# EAGLE design controller + diods + lcd (EAGLE 9.6.2)
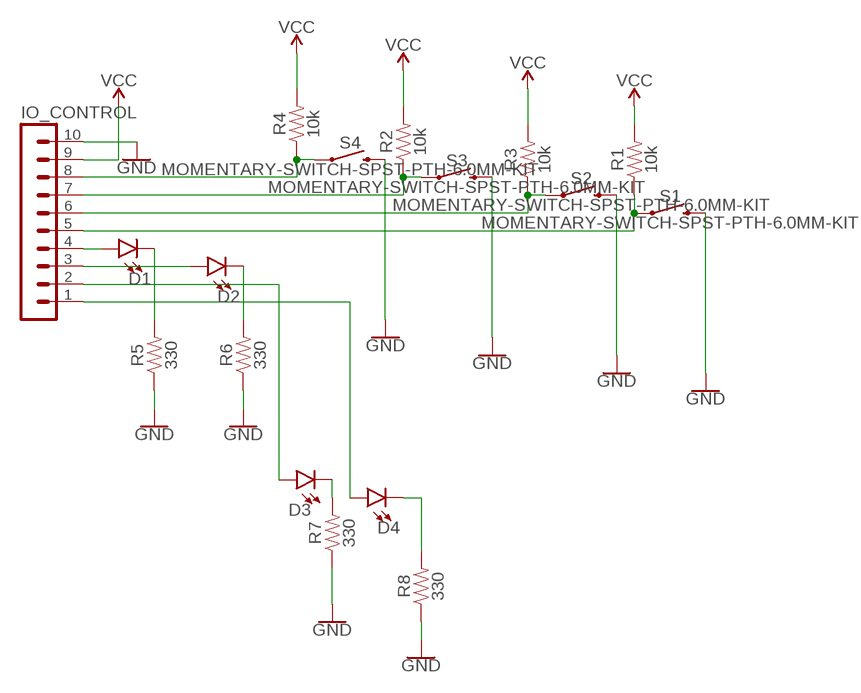
[diagram p0: schematic, sheet 1]

## Parts
D1  LED10MM  [LED_10MM]
D2  LED10MM  [LED_10MM]
D3  LED10MM  [LED_10MM]
D4  LED10MM  [LED_10MM]
IO_CONTROL  MA10-1  [MA10-1]
R1  10k  10KOHM-HORIZ_KIT-1/6W-5%  [AXIAL-0.3-KIT]
R2  10k  10KOHM-HORIZ_KIT-1/6W-5%  [AXIAL-0.3-KIT]
R3  10k  10KOHM-HORIZ_KIT-1/6W-5%  [AXIAL-0.3-KIT]
R4  10k  10KOHM-HORIZ_KIT-1/6W-5%  [AXIAL-0.3-KIT]
R5  330  330OHM-HORIZ-1/10W-5%  [AXIAL-0.3]
R6  330  330OHM-HORIZ-1/10W-5%  [AXIAL-0.3]
R7  330  330OHM-HORIZ-1/10W-5%  [AXIAL-0.3]
R8  330  330OHM-HORIZ-1/10W-5%  [AXIAL-0.3]
S1  MOMENTARY-SWITCH-SPST-PTH-6.0MM-KIT  [TACTILE_SWITCH_PTH_6.0MM_KIT]
S2  MOMENTARY-SWITCH-SPST-PTH-6.0MM-KIT  [TACTILE_SWITCH_PTH_6.0MM_KIT]
S3  MOMENTARY-SWITCH-SPST-PTH-6.0MM-KIT  [TACTILE_SWITCH_PTH_6.0MM_KIT]
S4  MOMENTARY-SWITCH-SPST-PTH-6.0MM-KIT  [TACTILE_SWITCH_PTH_6.0MM_KIT]

## Nets
GND: IO_CONTROL.10 R5.P$1 R6.P$1 R7.P$1 R8.P$1 S1.3 S2.3 S3.3 S4.3
N$2: IO_CONTROL.6 R3.P$1 S2.1
N$3: IO_CONTROL.7 R2.P$1 S3.1
N$4: IO_CONTROL.8 R4.P$1 S4.1
N$5: D1.A IO_CONTROL.4
N$6: D1.C R5.P$2
N$7: D2.A IO_CONTROL.3
N$8: D2.C R6.P$2
N$9: D3.A IO_CONTROL.2
N$10: D3.C R7.P$2
N$11: D4.A IO_CONTROL.1
N$12: D4.C R8.P$2
N$13: IO_CONTROL.5 R1.P$1 S1.1
VCC: IO_CONTROL.9 R1.P$2 R2.P$2 R3.P$2 R4.P$2

## Library data of the parts
D1-D4 = SparkFun-LED:LED: LED (Generic) Standard schematic elements and footprints for 5mm, 3mm, 1206, and 0603 sized LEDs. Generic LEDs with no color specified.
IO_CONTROL = con-lstb:MA10-1: PIN HEADER; OC_FARNELL: unknown; OC_NEWARK: unknown
R1-R4 = SparkFun-Resistors:10KOHM: 10kΩ resistor A resistor is a passive two-terminal electrical component that implements electrical resistance as a circuit element. Resistors act to reduce current flow, and, at the same time, act to lower voltage levels within circuits. - Wikipedia; PROD_ID: RES-08375
R5-R8 = SparkFun-Resistors:330OHM: 330Ω resistor A resistor is a passive two-terminal electrical component that implements electrical resistance as a circuit element. Resistors act to reduce current flow, and, at the same time, act to lower voltage levels within circuits. - Wikipedia; PROD_ID: RES-8371
S1-S4 = SparkFun-Switches:MOMENTARY-SWITCH-SPST: Momentary Switch (Pushbutton) - SPST Normally-open (NO) SPST momentary switches (buttons, pushbuttons). Variants PTH-12MM - 12mm square, through-hole Momentary Pushbutton Switch - 12mm Square <https://www.sparkfun.com/products/9190> (COM-09190) PTH-6.0MM, PTH-6.0MM-KIT - 6.0mm square, through-hole Mini Pushbutton Switch <https://www.sparkfun.com/products/97> (COM-00097) KIT package intended for soldering kit's - only one side of pads' copper is exposed. PTH-RIGHT-ANGLE-KIT - Right-angle, through-hole Right Angle Tactile Button <https://www.sparkfun.com/products/10791> - Used on SparkFun BigTime Watch Kit <https://www.sparkfun.com/products/11734> SMD-12MM - 12mm square, surface-mount Tactile Button - SMD (12mm) <https://www.sparkfun.com/products/12993> (COM-12993) Used on SparkFun PicoBoard <https://www.sparkfun.com/products/11888> SMD-4.5MM - 4.5mm Square Trackball Switch Used on SparkFun Blackberry Trackballer Breakout <https://www.sparkfun.com/products/13169> SMD-4.6MMX2.8MM - 4.60mm x 2.80mm, surface mount Used on SparkFun Pro Micro - RP2040 <https://www.sparkfun.com/products/17717> SMD-5.2MM, SMD-5.2-REDUNDANT - 5.2mm square, surface-mount Mini Pushbutton Switch - SMD <https://www.sparkfun.com/products/8720> (COM-08720) Used on Arduino Pro Mini <https://www.sparkfun.com/products/11114> REDUNDANT package connects both switch circuits together SMD-6.0X3.5MM - 6.0 x 3.5mm, surface mount Momentary Reset Switch SMD <https://www.sparkfun.com/products/8229> (COM-08229) SMD-6.2MM-TALL - 6.2mm square, surface mount Tactile Button - SMD (6mm) <https://www.sparkfun.com/products/12992> Used on SparkFun Digital Sandbox <https://www.sparkfun.com/products/12651> SMD-RIGHT-ANGLE - Right-angle, surface mount Used on SparkFun Block for Intel® Edison - Arduino <https://www.sparkfun.com/products/13036>; PROD_ID: SWCH-08441; SF_SKU: COM-00097

## Board
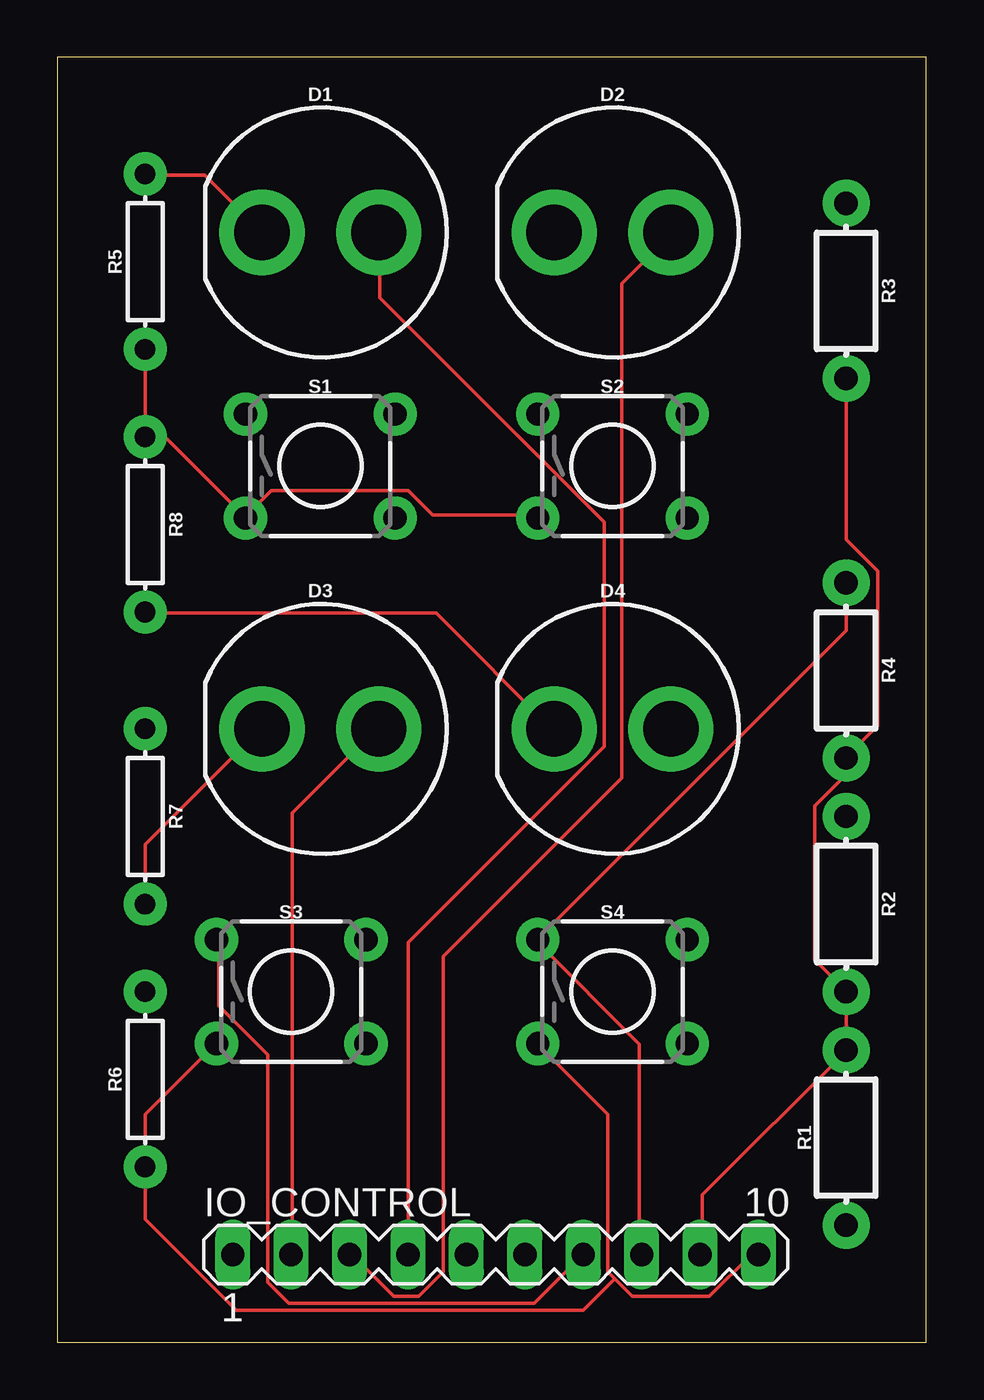
[diagram p1: board, top side]
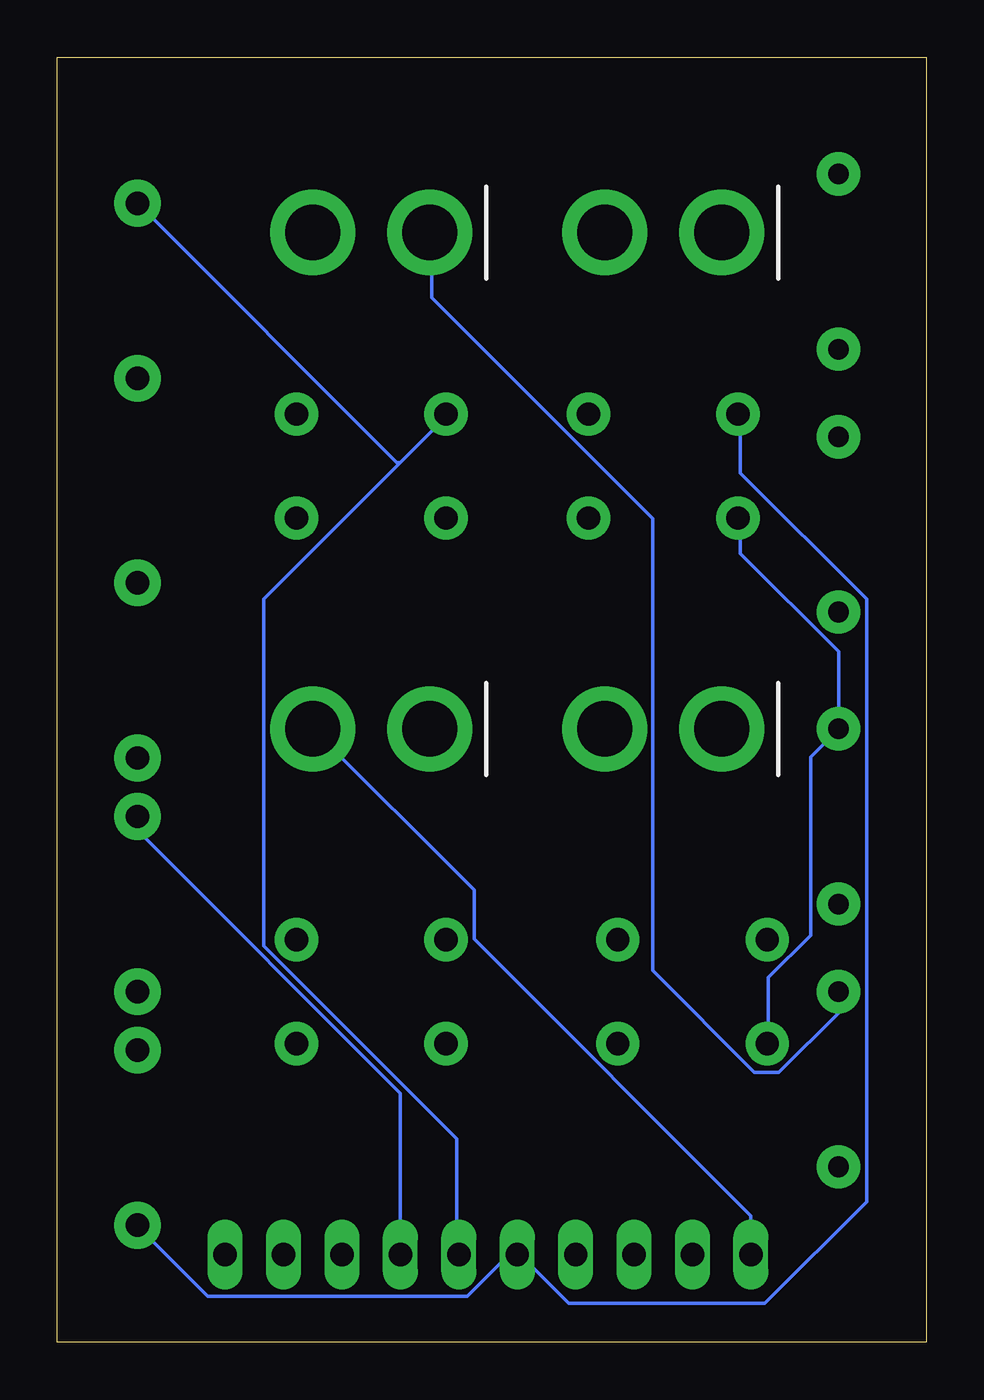
[diagram p2: board, bottom side, seen from below]

Size 37.77 x 55.87 mm. Coordinates in mm from the lower left corner, seen from the top.
Outline: 0,0 37.77,0 37.77,55.87 0,55.87 0,0
Copper layers (1*16): Top 0.035mm / dielectric 1.5mm / Bottom 0.035mm
Design rules "default": minimum track width 6mil, minimum drill 0.35mm, track to track 6mil, track to pad 6mil, pad to pad 6mil, via to via 6mil, smd to smd 6mil, copper to edge 40mil, drill to drill 6mil, minimum pad ring 10mil, minimum via ring 8mil, stop-mask expansion 4mil, vias tented up to drill 0mil, thermal gap 10mil

### Footprints (pad centres in the part's own frame; a part is rotated, then mirrored left to right if it is on the bottom)
LED_10MM = drill 2.4 pad 3.7: A 2.54,0; C -2.54,0
MA10-1 = drill 1.016 long: 1 -11.43,0; 2 -8.89,0; 3 -6.35,0; 4 -3.81,0; 5 -1.27,0; 6 1.27,0; 7 3.81,0; 8 6.35,0; 9 8.89,0; 10 11.43,0
AXIAL-0.3-KIT = drill 1.016 pad 2.032: P$1 -3.81,0; P$2 3.81,0
AXIAL-0.3 = drill 0.9 pad 1.88: P$1 -3.81,0; P$2 3.81,0
TACTILE_SWITCH_PTH_6.0MM_KIT = drill 1.016 pad 1.88: 1 -3.251,2.261; 2 3.251,2.261; 3 -3.251,-2.261; 4 3.251,-2.261

### Placement (x,y rotation side)
D1  11.43,48.26 0 top
D2  24.13,48.26 0 top
D3  11.43,26.67 0 top
D4  24.13,26.67 0 top
IO_CONTROL  19.05,3.81 0 top
R1  34.29,8.89 90 top
R2  34.29,19.05 270 top
R3  34.29,45.72 270 top
R4  34.29,29.21 270 top
R5  3.81,46.99 90 top
R6  3.81,11.43 90 top
R7  3.81,22.86 270 top
R8  3.81,35.56 270 top
S1  11.43,38.1 0 top
S2  24.13,38.1 0 top
S3  10.16,15.24 0 top
S4  24.13,15.24 0 top

### Tracks (layer width: path | path; a pad name or v marks a point on that pad's centre or on a via)
GND
  Top 0.152: IO_CONTROL.10 30.18,3.81 28.35,1.98 24.99,1.98 24.23,2.74 | 24.23,2.74 23.93,3.05 23.93,9.91 20.88,12.95 S4.3 | S3.3 6.86,12.95 3.81,9.91 R6.P$1 3.81,5.33 7.77,1.37 22.86,1.37 24.23,2.74 | R5.P$1 R8.P$1 3.81,39.32 4.72,39.32 8.08,35.97 S1.3 8.23,35.97 9.3,37.03 15.24,37.03 16.31,35.97 20.88,35.97 S2.3
  Bottom 0.152: S1.3 8.08,35.81 8.08,34.29 3.81,30.02 R7.P$1 5.03,25.45 5.03,17.68 6.86,15.85 6.86,13.11 S3.3
N$2
  Bottom 0.152: 22.86,38.25 20.88,40.23 S2.1 | 22.86,38.25 28.8,32.31 28.8,17.22 20.42,8.84 20.42,3.81 IO_CONTROL.6 | R3.P$1 23.01,38.25 22.86,38.25
N$3
  Top 0.152: IO_CONTROL.7 20.73,1.68 10.06,1.68 9.14,2.59 9.14,12.5 7.01,14.63 7.01,17.37 S3.1
  Bottom 0.152: IO_CONTROL.7 22.86,10.82 34.29,22.25 R2.P$1
N$4
  Top 0.152: IO_CONTROL.8 25.3,3.81 25.3,12.95 20.88,17.37 S4.1 20.88,17.53 34.29,30.94 R4.P$1
N$5
  Top 0.152: IO_CONTROL.4 15.24,17.37 23.77,25.91 23.77,35.66 14.02,45.41 14.02,48.16 D1.A
N$6
  Top 0.152: D1.C 6.4,50.75 3.81,50.75 R5.P$2
N$7
  Top 0.152: IO_CONTROL.3 12.8,3.81 14.63,1.98 15.7,1.98 16.76,3.05 16.76,16.76 24.54,24.54 24.54,46.02 26.67,48.16 D2.A
N$8
  Bottom 0.152: R6.P$2 3.81,14.33 6.4,11.73 7.47,11.73 11.89,16.15 11.89,35.81 21.49,45.41 21.49,48.16 D2.C
N$9
  Top 0.152: IO_CONTROL.2 10.21,3.81 10.21,23.01 13.87,26.67 D3.A
N$10
  Top 0.152: R7.P$2 3.81,21.64 8.84,26.67 D3.C
N$11
  Bottom 0.152: IO_CONTROL.1 7.62,5.49 19.66,17.53 19.66,19.66 D4.A
N$12
  Top 0.152: R8.P$2 3.81,31.7 16.46,31.7 21.49,26.67 D4.C
N$13
  Bottom 0.152: R1.P$1 34.29,5.03 31.24,1.98 19.96,1.98 18.14,3.81 IO_CONTROL.5 17.68,3.81 15.54,1.68 7.01,1.68 2.59,6.1 2.59,32.31 8.08,37.8 8.08,40.23 S1.1
VCC
  Top 0.152: IO_CONTROL.9 28.04,3.81 28.04,6.4 34.29,12.65 R1.P$2 R2.P$2 32.92,16.61 32.92,23.32 34.29,24.69 R4.P$2 34.29,25.45 35.66,26.82 35.66,33.53 34.29,34.9 R3.P$2